# Altium project MANGO.PrjPCB
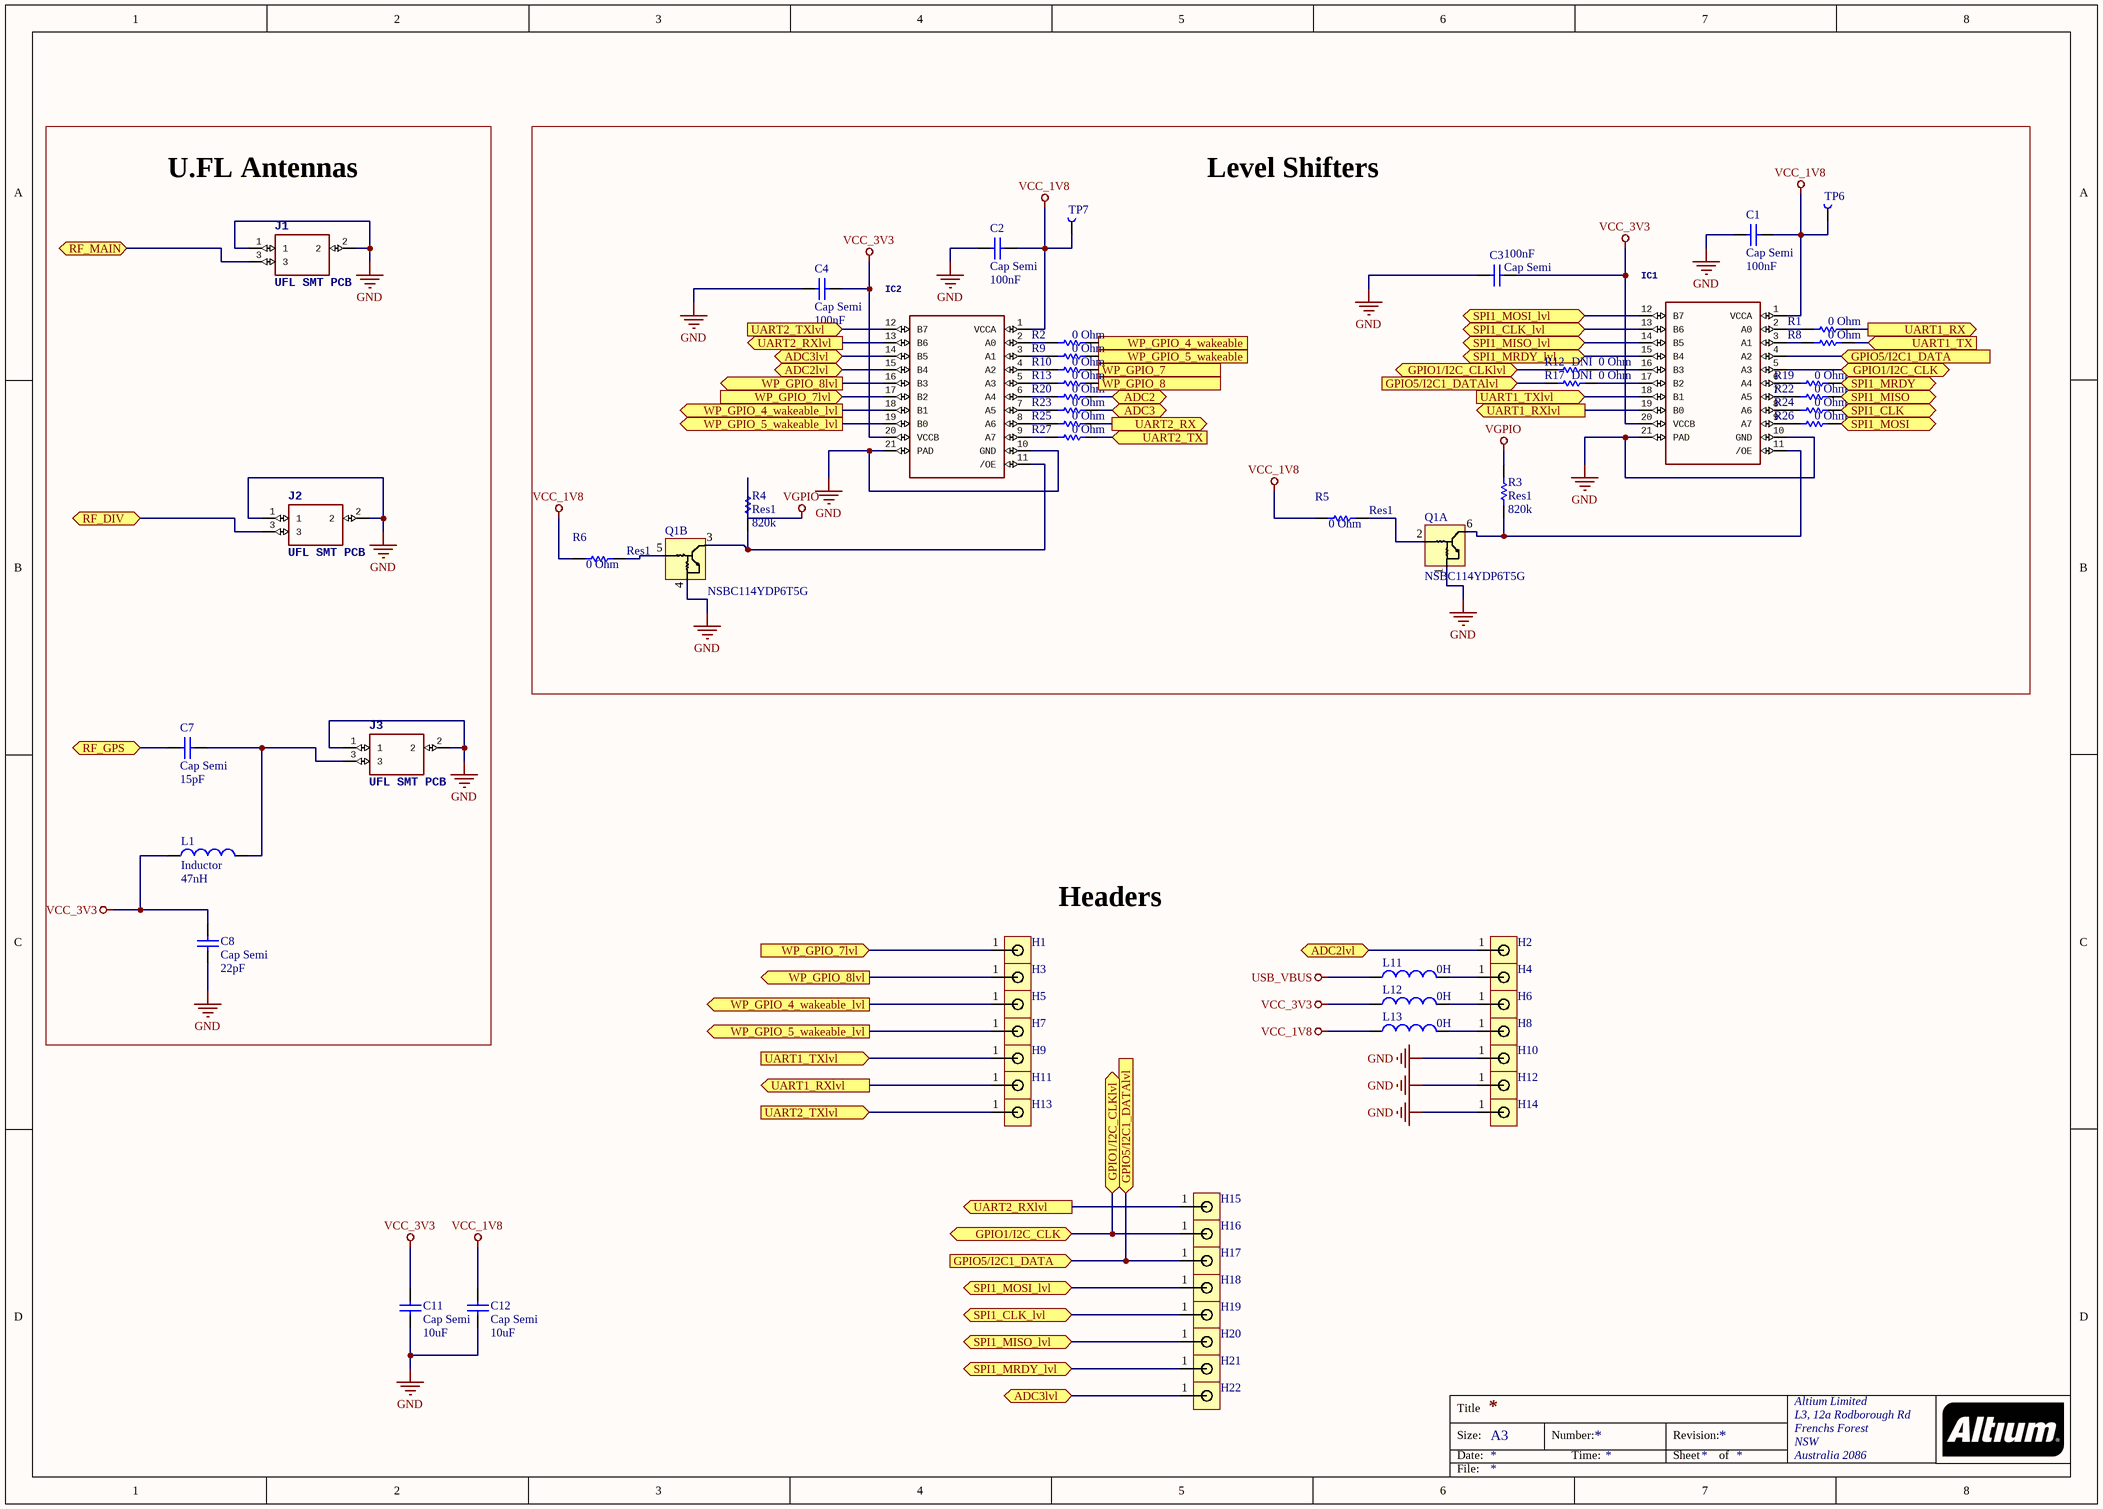
[diagram p0: Sheet1.SchDoc]
3 sheets, 93 parts. Net scope: flat (ports and power ports of the same name join across sheets).
Board file: PCB1.PcbDoc
Sheets:
  Sheet1.SchDoc
  Sheet3.SchDoc
  Sheet4.SchDoc

## Sheet Sheet1.SchDoc
size A3; Organization: Altium Limited; Address1: L3, 12a Rodborough Rd; Address2: Frenchs Forest; Address3: NSW; Address4: Australia 2086

### Parts
C1  Cap Semi  value 100nF  [CAP 0402/1005]
C2  Cap Semi  value 100nF  [CAP 0402/1005]
C3  Cap Semi  value 100nF  [CAP 0402/1005]
C4  Cap Semi  value 100nF  [CAP 0402/1005]
C7  Cap Semi  value 15pF  [CAP 0402/1005]
C8  Cap Semi  value 22pF  [CAP 0402/1005]
C11  Cap Semi  value 10uF  [CAP 0603/1608]
C12  Cap Semi  value 10uF  [CAP 0603/1608]
H1  Header 1  [PIN1-3D]  (value not drawn)
H2  Header 1  [PIN1-3D]  (value not drawn)
H3  Header 1  [PIN1-3D]  (value not drawn)
H4  Header 1  [PIN1-3D]  (value not drawn)
H5  Header 1  [PIN1-3D]  (value not drawn)
H6  Header 1  [PIN1-3D]  (value not drawn)
H7  Header 1  [PIN1-3D]  (value not drawn)
H8  Header 1  [PIN1-3D]  (value not drawn)
H9  Header 1  [PIN1-3D]  (value not drawn)
H10  Header 1  [PIN1-3D]  (value not drawn)
H11  Header 1  [PIN1-3D]  (value not drawn)
H12  Header 1  [PIN1-3D]  (value not drawn)
H13  Header 1  [PIN1-3D]  (value not drawn)
H14  Header 1  [PIN1-3D]  (value not drawn)
H15  Header 1  [PIN1-3D]  (value not drawn)
H16  Header 1  [PIN1-3D]  (value not drawn)
H17  Header 1  [PIN1-3D]  (value not drawn)
H18  Header 1  [PIN1-3D]  (value not drawn)
H19  Header 1  [PIN1-3D]  (value not drawn)
H20  Header 1  [PIN1-3D]  (value not drawn)
H21  Header 1  [PIN1-3D]  (value not drawn)
H22  Header 1  [PIN1-3D]  (value not drawn)
IC1  (no value)  [DQFN-20]
IC2  (no value)  [DQFN-20]
J1  UFL SMT PCB  [U.FL-R-SMT-1(10)]
J2  UFL SMT PCB  [U.FL-R-SMT-1(10)]
J3  UFL SMT PCB  [U.FL-R-SMT-1(10)]
L1  Inductor  value 47nH  [IND 0402/1005 RF WW]
L11  value 0H  [INDC1608L]  (hidden comment: Inductor)
L12  value 0H  [INDC1608L]  (hidden comment: Inductor)
L13  value 0H  [INDC1608L]  (hidden comment: Inductor)
Q1  NSBC114YDP6T5G  [NSBC114YDP6T5G]  (parts A,B of 2)
R1  value 0 Ohm  [RES 0402/1005]  (hidden comment: Res1)
R2  value 0 Ohm  [RES 0402/1005]  (hidden comment: Res1)
R3  Res1  value 820k  [RES 0402/1005]
R4  Res1  value 820k  [RES 0402/1005]
R5  Res1  value 0 Ohm  [RES 0402/1005]
R6  Res1  value 0 Ohm  [RES 0402/1005]
R8  value 0 Ohm  [RES 0402/1005]  (hidden comment: Res1)
R9  value 0 Ohm  [RES 0402/1005]  (hidden comment: Res1)
R10  value 0 Ohm  [RES 0402/1005]  (hidden comment: Res1)
R12  DNI  value 0 Ohm  [RES 0402/1005]
R13  value 0 Ohm  [RES 0402/1005]  (hidden comment: Res1)
R17  DNI  value 0 Ohm  [RES 0402/1005]
R19  value 0 Ohm  [RES 0402/1005]  (hidden comment: Res1)
R20  value 0 Ohm  [RES 0402/1005]  (hidden comment: Res1)
R22  value 0 Ohm  [RES 0402/1005]  (hidden comment: Res1)
R23  value 0 Ohm  [RES 0402/1005]  (hidden comment: Res1)
R24  value 0 Ohm  [RES 0402/1005]  (hidden comment: Res1)
R25  value 0 Ohm  [RES 0402/1005]  (hidden comment: Res1)
R26  value 0 Ohm  [RES 0402/1005]  (hidden comment: Res1)
R27  value 0 Ohm  [RES 0402/1005]  (hidden comment: Res1)
TP6  TestPoint  [TestPoint]  (value not drawn)
TP7  TestPoint  [TestPoint]  (value not drawn)

### Blocks framed on the sheet
U.FL Antennas: C7 C8 J1-J3 L1
Level Shifters: C1-C4 IC1 IC2 Q1 R1-R6 R8-R10 R12 R13 R17 R19 R20 R22-R27 TP6 TP7

### Ports
ADC2 (bidir), ADC2lvl (bidir), ADC3 (bidir), ADC3lvl (bidir), GPIO1/I2C_CLK (bidir), GPIO1/I2C_CLKlvl (bidir), GPIO5/I2C1_DATA (in), GPIO5/I2C1_DATAlvl (in), RF_DIV (bidir), RF_GPS (bidir), RF_MAIN (bidir), SPI1_CLK (bidir), SPI1_CLK_lvl (bidir), SPI1_MISO (bidir), SPI1_MISO_lvl (bidir), SPI1_MOSI (bidir), SPI1_MOSI_lvl (bidir), SPI1_MRDY (bidir), SPI1_MRDY_lvl (bidir), UART1_RX (out), UART1_RXlvl (out), UART1_TX (in), UART1_TXlvl (in), UART2_RX (out), UART2_RXlvl (out), UART2_TX (in), UART2_TXlvl (in), WP_GPIO_4_wakeable (out), WP_GPIO_4_wakeable_lvl (out), WP_GPIO_5_wakeable (out), WP_GPIO_5_wakeable_lvl (out), WP_GPIO_7 (in), WP_GPIO_7lvl (in), WP_GPIO_8 (out), WP_GPIO_8lvl (out)

### Nets
GND: C1.2 C2.2 C3.2 C4.2 C8.2 C11.1 C12.1 H10.1 H12.1 H14.1 IC1.10(GND) IC1.21(PAD) IC2.10(GND) IC2.21(PAD) J1.1 J1.2 J2.1 J2.2 J3.1 J3.2 Q1.1 Q1.4
USB_VBUS: L11.1
VCC_1V8: C1.1 C2.1 C12.2 IC1.1(VCCA) IC2.1(VCCA) L13.1 R5.1 R6.1 TP6.1(TP) TP7.1(TP)
VCC_3V3: C3.1 C4.1 C8.1 C11.2 IC1.20(VCCB) IC2.20(VCCB) L1.1 L12.1
VGPIO: R3.2 R4.2
NetC7_1: C7.1 J3.3 L1.2
NetC7_2: C7.2 ; port RF_GPS
NetH1_1: H1.1 IC2.17(B2) ; port WP_GPIO_7lvl
NetH2_1: H2.1 IC2.15(B4) ; port ADC2lvl
NetH3_1: H3.1 IC2.16(B3) ; port WP_GPIO_8lvl
NetH4_1: H4.1 L11.2
NetH5_1: H5.1 IC2.18(B1) ; port WP_GPIO_4_wakeable_lvl
NetH6_1: H6.1 L12.2
NetH7_1: H7.1 IC2.19(B0) ; port WP_GPIO_5_wakeable_lvl
NetH8_1: H8.1 L13.2
NetH9_1: H9.1 IC1.18(B1) ; port UART1_TXlvl
NetH11_1: H11.1 IC1.19(B0) ; port UART1_RXlvl
NetH13_1: H13.1 IC2.12(B7) ; port UART2_TXlvl
NetH15_1: H15.1 IC2.13(B6) ; port UART2_RXlvl
NetH16_1: H16.1 IC1.5(A3) R12.1 ; port GPIO1/I2C_CLK, port GPIO1/I2C_CLKlvl
NetH17_1: H17.1 IC1.4(A2) R17.1 ; port GPIO5/I2C1_DATA, port GPIO5/I2C1_DATAlvl
NetH18_1: H18.1 IC1.12(B7) ; port SPI1_MOSI_lvl
NetH19_1: H19.1 IC1.13(B6) ; port SPI1_CLK_lvl
NetH20_1: H20.1 IC1.14(B5) ; port SPI1_MISO_lvl
NetH21_1: H21.1 IC1.15(B4) ; port SPI1_MRDY_lvl
NetH22_1: H22.1 IC2.14(B5) ; port ADC3lvl
NetIC1_2: IC1.2(A0) R1.1
NetIC1_3: IC1.3(A1) R8.1
NetIC1_6: IC1.6(A4) R19.1
NetIC1_7: IC1.7(A5) R22.1
NetIC1_8: IC1.8(A6) R24.1
NetIC1_9: IC1.9(A7) R26.1
NetIC1_11: IC1.11(/OE) Q1.6 R3.1
NetIC1_16: IC1.16(B3) R12.2
NetIC1_17: IC1.17(B2) R17.2
NetIC2_2: IC2.2(A0) R2.1
NetIC2_3: IC2.3(A1) R9.1
NetIC2_4: IC2.4(A2) R10.1
NetIC2_5: IC2.5(A3) R13.1
NetIC2_6: IC2.6(A4) R20.1
NetIC2_7: IC2.7(A5) R23.1
NetIC2_8: IC2.8(A6) R25.1
NetIC2_9: IC2.9(A7) R27.1
NetIC2_11: IC2.11(/OE) Q1.3 R4.1
NetJ1_3: J1.3 ; port RF_MAIN
NetJ2_3: J2.3 ; port RF_DIV
NetQ1_2: Q1.2 R5.2
NetQ1_5: Q1.5 R6.2
NetR1_2: R1.2 ; port UART1_RX
NetR2_2: R2.2 ; port WP_GPIO_4_wakeable
NetR8_2: R8.2 ; port UART1_TX
NetR9_2: R9.2 ; port WP_GPIO_5_wakeable
NetR10_2: R10.2 ; port WP_GPIO_7
NetR13_2: R13.2 ; port WP_GPIO_8
NetR19_2: R19.2 ; port SPI1_MRDY
NetR20_2: R20.2 ; port ADC2
NetR22_2: R22.2 ; port SPI1_MISO
NetR23_2: R23.2 ; port ADC3
NetR24_2: R24.2 ; port SPI1_CLK
NetR25_2: R25.2 ; port UART2_RX
NetR26_2: R26.2 ; port SPI1_MOSI
NetR27_2: R27.2 ; port UART2_TX

### Notes on the sheet
- Headers
- Title
- Size:
- Date:
- A3
- Number:
- Time:
- Revision:
- Sheet
- of
- File:

### Library data of the parts
C1-C4 = Cap Semi: 0.1µF -20%, +80% 16V Ceramic Capacitor Y5V (F) 0402 (1005 Metric); Part Number: VJ0402V104ZXJCW1BC; Published: 8-Jun-2000; LatestRevisionDate: 29-May-2009; LatestRevisionNote: IPC-7351 Footprint Added.; PackageReference: C1206; PackageDescription: Chip Capacitor; Supplier Link: https://www.digikey.com/product-detail/en/vishay-vitramon/VJ0402V104ZXJCW1BC/720-1523-1-ND/420979
C7 = Cap Semi: 15pF ±5% 50V Ceramic Capacitor C0G, NP0 0402 (1005 Metric); Part Number: UMK105CG150JV-F; LatestRevisionDate: 29-May-2009; LatestRevisionNote: IPC-7351 Footprint Added.; PackageReference: C1206; PackageDescription: Chip Capacitor; Supplier Link: https://www.digikey.com/product-detail/en/taiyo-yuden/UMK105CG150JV-F/587-1949-1-ND/1473259
C8 = Cap Semi: CAP CER 22PF 50V NP0 0402; Part Number: UMK105CG220JV-F; Published: 8-Jun-2000; LatestRevisionDate: 29-May-2009; LatestRevisionNote: IPC-7351 Footprint Added.; PackageReference: C1206; PackageDescription: Chip Capacitor; Supplier Link: https://www.digikey.com/product-detail/en/taiyo-yuden/UMK105CG220JV-F/587-1203-1-ND/930980
C11 C12 = Cap Semi: 10µF ±20% 6.3V Ceramic Capacitor X5R 0603 (1608 Metric); Part Number: JMK107BJ106MA-T; LatestRevisionDate: 29-May-2009; LatestRevisionNote: IPC-7351 Footprint Added.; PackageReference: C1206; Publisher: Altium Limited; PackageDescription: Chip Capacitor; Supplier Link: https://www.digikey.com/product-detail/en/taiyo-yuden/JMK107BJ106MA-T/587-1256-1-ND/931033
IC1 IC2 = FXMA108BQX: Voltage Level Translator Bidirectional 1 Circuit 8 Channel 100Mbps 20-DQFN (2.5x4.5); Manufacturer_Name: Fairchild Semiconductor; GateName_1: G$1; SymbolName_1: FXMA108BQX; LibraryName: FXMA108BQX; DeviceSetName: FXMA108BQX; Package: DQFN-20; Part Number: FXMA108BQX; Mouser_Part_Number: 512-FXMA108BQX; Supplier Link: https://www.digikey.com/product-detail/en/on-semiconductor/FXMA108BQX/FXMA108BQXFSCT-ND/2287325; RS_Part_Number: 8076121P; RS_Price-Stock: http://uk.rs-online.com/web/p/products/8076121P; Height: mm
J1-J3 = U.FL-R-SMT-1(10): U.FL (UMCC), IPEX MHF1 Connector Receptacle, Male Pin 50 Ohm Surface Mount Solder; Part Number: 20279-001E-01; Manufacturer_Name: Taoglas; Manufacturer_Part_Number: U.FL-R-SMT-1(10); Height: mm; Supplier Link: https://www.digikey.com/products/en?keywords=20279-001E-01
L1 = Inductor: 47nH Unshielded Multilayer Inductor 250mA 1.15 Ohm Max 0402 (1005 Metric); Part Number: LQG15HN47NJ02D; Code_IEC: 1005; Published: 8-Jun-2000; LatestRevisionDate: 29-May-2009; LatestRevisionNote: IPC-7351 Footprint Added.; PackageReference: 0402-A; PackageDescription: Chip Inductor; Code_JEITA: 0402; Supplier Link: https://www.digikey.com/product-detail/en/murata-electronics-north-america/LQG15HN47NJ02D/490-1093-1-ND/584539
L11-L13 = Inductor: 220 Ohms @ 100MHz 1 Power Line Ferrite Bead 0603 (1608 Metric) 2.2A 50 mOhm; Part Number: MPZ1608S221ATA00; Code_IEC: 1005; Published: 8-Jun-2000; LatestRevisionDate: 29-May-2009; LatestRevisionNote: IPC-7351 Footprint Added.; PackageReference: 0402-A; Publisher: Altium Limited; PackageDescription: Chip Inductor; Code_JEITA: 0402; Supplier Link: https://www.digikey.com/product-detail/en/tdk-corporation/MPZ1608S221ATA00/445-1565-1-ND/571895
Q1 = NSBC114YDP6T5G: Pre-Biased Bipolar Transistor (BJT) 2 NPN - Pre-Biased (Dual) 50V 100mA  339mW Surface Mount SOT-963; Part Number: NSBC114YDP6T5G; Supplier Link: https://www.digikey.com/product-detail/en/on-semiconductor/NSBC114YDP6T5G/NSBC114YDP6T5GOSCT-ND/9087466
R1 R2 R5 R6 R8-R10 R12 R13 R17 R19 R20 R22-R27 = Res1: 0 Ohms Jumper  Chip Resistor 0402 (1005 Metric) Automotive AEC-Q200 Metal Element; Part Number: RK73Z1ETTP; Published: 8-Jun-2000; LatestRevisionDate: 17-Jul-2002; LatestRevisionNote: Re-released for DXP Platform.; PackageReference: AXIAL-0.3; PackageDescription: Axial Device, Thru-Hole; 2 Leads; 0.3 in Pin Spacing; Supplier Link: https://www.digikey.com/product-detail/en/koa-speer-electronics-inc/RK73Z1ETTP/2019-RK73Z1ETTPCT-ND/9846740
R3 R4 = Res1: 820 kOhms ±1% 0.063W, 1/16W Chip Resistor 0402 (1005 Metric) Moisture Resistant Thick Film; Part Number: RC0402FR-07820KL; Published: 8-Jun-2000; LatestRevisionDate: 17-Jul-2002; LatestRevisionNote: Re-released for DXP Platform.; PackageReference: AXIAL-0.3; PackageDescription: Axial Device, Thru-Hole; 2 Leads; 0.3 in Pin Spacing; Supplier Link: https://www.digikey.com/product-detail/en/yageo/RC0402FR-07820KL/YAG3240CT-ND/5282105

## Sheet Sheet3.SchDoc
size A4; Organization: Altium Limited; Address1: L3, 12a Rodborough Rd; Address2: Frenchs Forest; Address3: NSW; Address4: Australia 2086
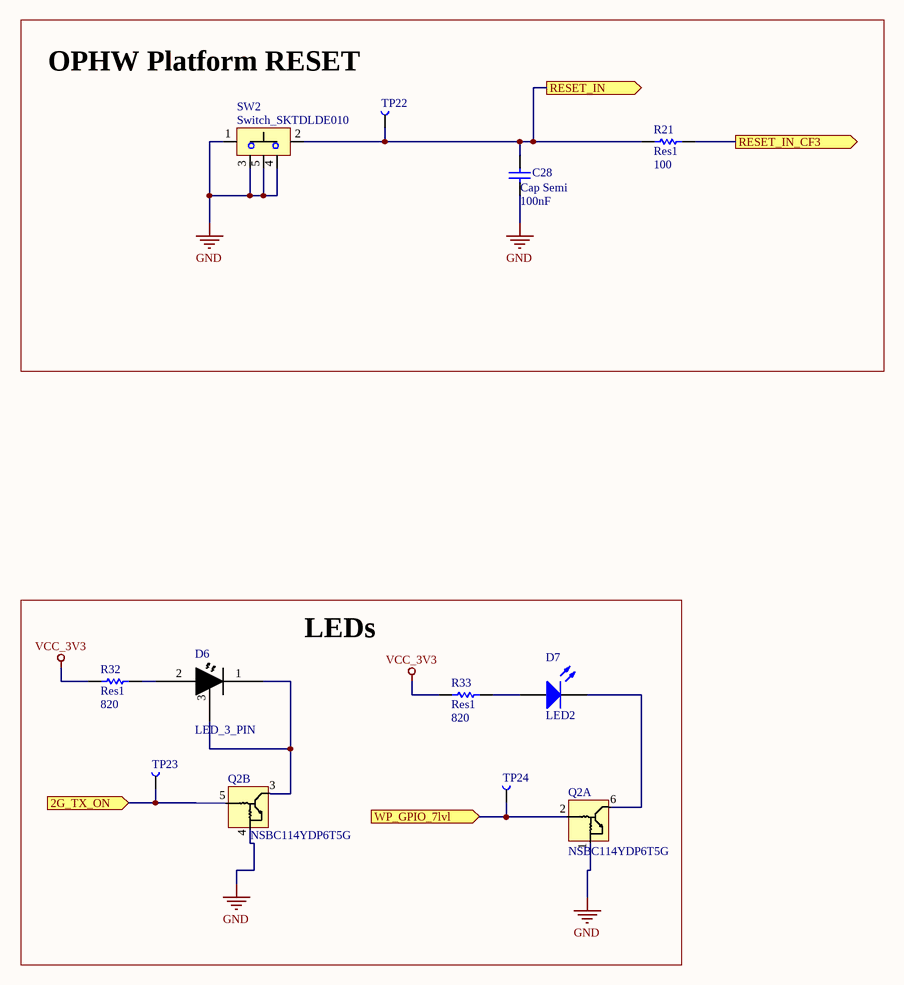
[diagram p1: Sheet3.SchDoc]

### Parts
C28  Cap Semi  value 100nF  [CAP 0402/1005]
D6  LED_3_PIN  [LED_3_PIN]
D7  LED2  [LED_0603 - 3D]
Q2  NSBC114YDP6T5G  [NSBC114YDP6T5G]  (parts A,B of 2)
R21  Res1  value 100  [RES 0402/1005]
R32  Res1  value 820  [RES 0402/1005]
R33  Res1  value 820  [RES 0402/1005]
SW2  Switch_SKTDLDE010  [Switch_SKTDLDE010]
TP22  TestPoint  [TestPoint]  (value not drawn)
TP23  TestPoint  [TestPoint]  (value not drawn)
TP24  TestPoint  [TestPoint]  (value not drawn)

### Blocks framed on the sheet
OPHW Platform RESET: C28 R21 SW2 TP22
LEDs: D6 D7 Q2 R32 R33 TP23 TP24

### Ports
2G_TX_ON (in), RESET_IN (out), RESET_IN_CF3 (out), WP_GPIO_7lvl (in)

### Nets
GND: C28.1 Q2.1 Q2.4 SW2.1 SW2.3 SW2.4 SW2.5
VCC_3V3: R32.2 R33.2
NetC28_2: C28.2 R21.1 SW2.2 TP22.1(TP) ; port RESET_IN
NetD6_1: D6.1 D6.3 Q2.3
NetD6_2: D6.2 R32.1
NetD7_1: D7.1(A) R33.1
NetD7_2: D7.2(K) Q2.6
NetH1_1: Q2.2 TP24.1(TP) ; port WP_GPIO_7lvl
NetQ2_5: Q2.5 TP23.1(TP) ; port 2G_TX_ON
NetR21_2: R21.2 ; port RESET_IN_CF3

### Notes on the sheet
- Title
- Size:
- Date:
- A4
- Number:
- Time:
- Revision:
- Sheet
- of
- File:

### Library data of the parts
C28 = Cap Semi: as C1 on sheet Sheet1; Published: 8-Jun-2000; LatestRevisionDate: 29-May-2009; LatestRevisionNote: IPC-7351 Footprint Added.; PackageReference: C1206; PackageDescription: Chip Capacitor; Supplier Link: https://www.digikey.com/product-detail/en/vishay-vitramon/VJ0402V104ZXJCW1BC/720-1523-1-ND/420979
D6 = LED_3_PIN: Yellow-Green 573nm LED Indication - Discrete 2V 2-SMD, No Lead; Part Number: 12-21SYGC/S530-E2/TR8; Supplier Link: https://www.digikey.com/product-detail/en/everlight-electronics-co-ltd/12-21SYGC-S530-E2-TR8/1080-1451-1-ND/5308153
D7 = LED2: Green  LED Indication - Discrete 2.2V 0603 (1608 Metric); Part Number: SML-310MTT86; Published: 8-Jun-2000; LatestRevisionDate: 17-Jul-2002; LatestRevisionNote: Re-released for DXP Platform.; PackageVersion: Feb-2002; PackageReference: 3.2X1.6X1.1; Publisher: Altium Limited; PackageDescription: SM LED; 2 Flat Leads; Supplier Link: https://www.digikey.com/products/en?keywords=SML-310MTT86M
Q2 = NSBC114YDP6T5G: as Q1 on sheet Sheet1; Part Number: NSBC114YDP6T5G; Supplier Link: https://www.digikey.com/product-detail/en/on-semiconductor/NSBC114YDP6T5G/NSBC114YDP6T5GOSCT-ND/9087466
R21 = Res1: 100 Ohms ±5% 0.063W, 1/16W Chip Resistor 0402 (1005 Metric) Automotive AEC-Q200 Thick Film; Part Number: MCR01MZPJ101; Available: 0; Published: 8-Jun-2000; LatestRevisionDate: 17-Jul-2002; LatestRevisionNote: Re-released for DXP Platform.; PackageReference: AXIAL-0.3; PackageDescription: Axial Device, Thru-Hole; 2 Leads; 0.3 in Pin Spacing; Supplier Link: https://www.digikey.com/product-detail/en/rohm-semiconductor/MCR01MZPJ101/RHM100JCT-ND/628224; Supplier Link 2: https://www.digikey.com/product-detail/en/yageo/AC0402JR-07100RL/YAG3516CT-ND/6006365; Part Number 2: AC0402JR-07100RL
R32 R33 = Res1: 820 Ohms ±5% 0.1W, 1/10W Chip Resistor 0402 (1005 Metric) Automotive AEC-Q200 Thick Film; Part Number: RK73B1ETTP821J; Published: 8-Jun-2000; LatestRevisionDate: 17-Jul-2002; LatestRevisionNote: Re-released for DXP Platform.; PackageReference: AXIAL-0.3; PackageDescription: Axial Device, Thru-Hole; 2 Leads; 0.3 in Pin Spacing; Supplier Link: https://www.digikey.com/product-detail/en/koa-speer-electronics-inc/RK73B1ETTP821J/2019-RK73B1ETTP821JCT-ND/9846073
SW2 = Switch_SKTDLDE010: Tactile Switches Tact Switch; Part Number: SKTDLDE010; Supplier Link: https://eu.mouser.com/ProductDetail/ALPS/SKTDLDE010?qs=RiQAlOPxzzDSD3ErBzCWyg%3D%3D

## Sheet Sheet4.SchDoc
size A3; Organization: Altium Limited; Address1: L3, 12a Rodborough Rd; Address2: Frenchs Forest; Address3: NSW; Address4: Australia 2086
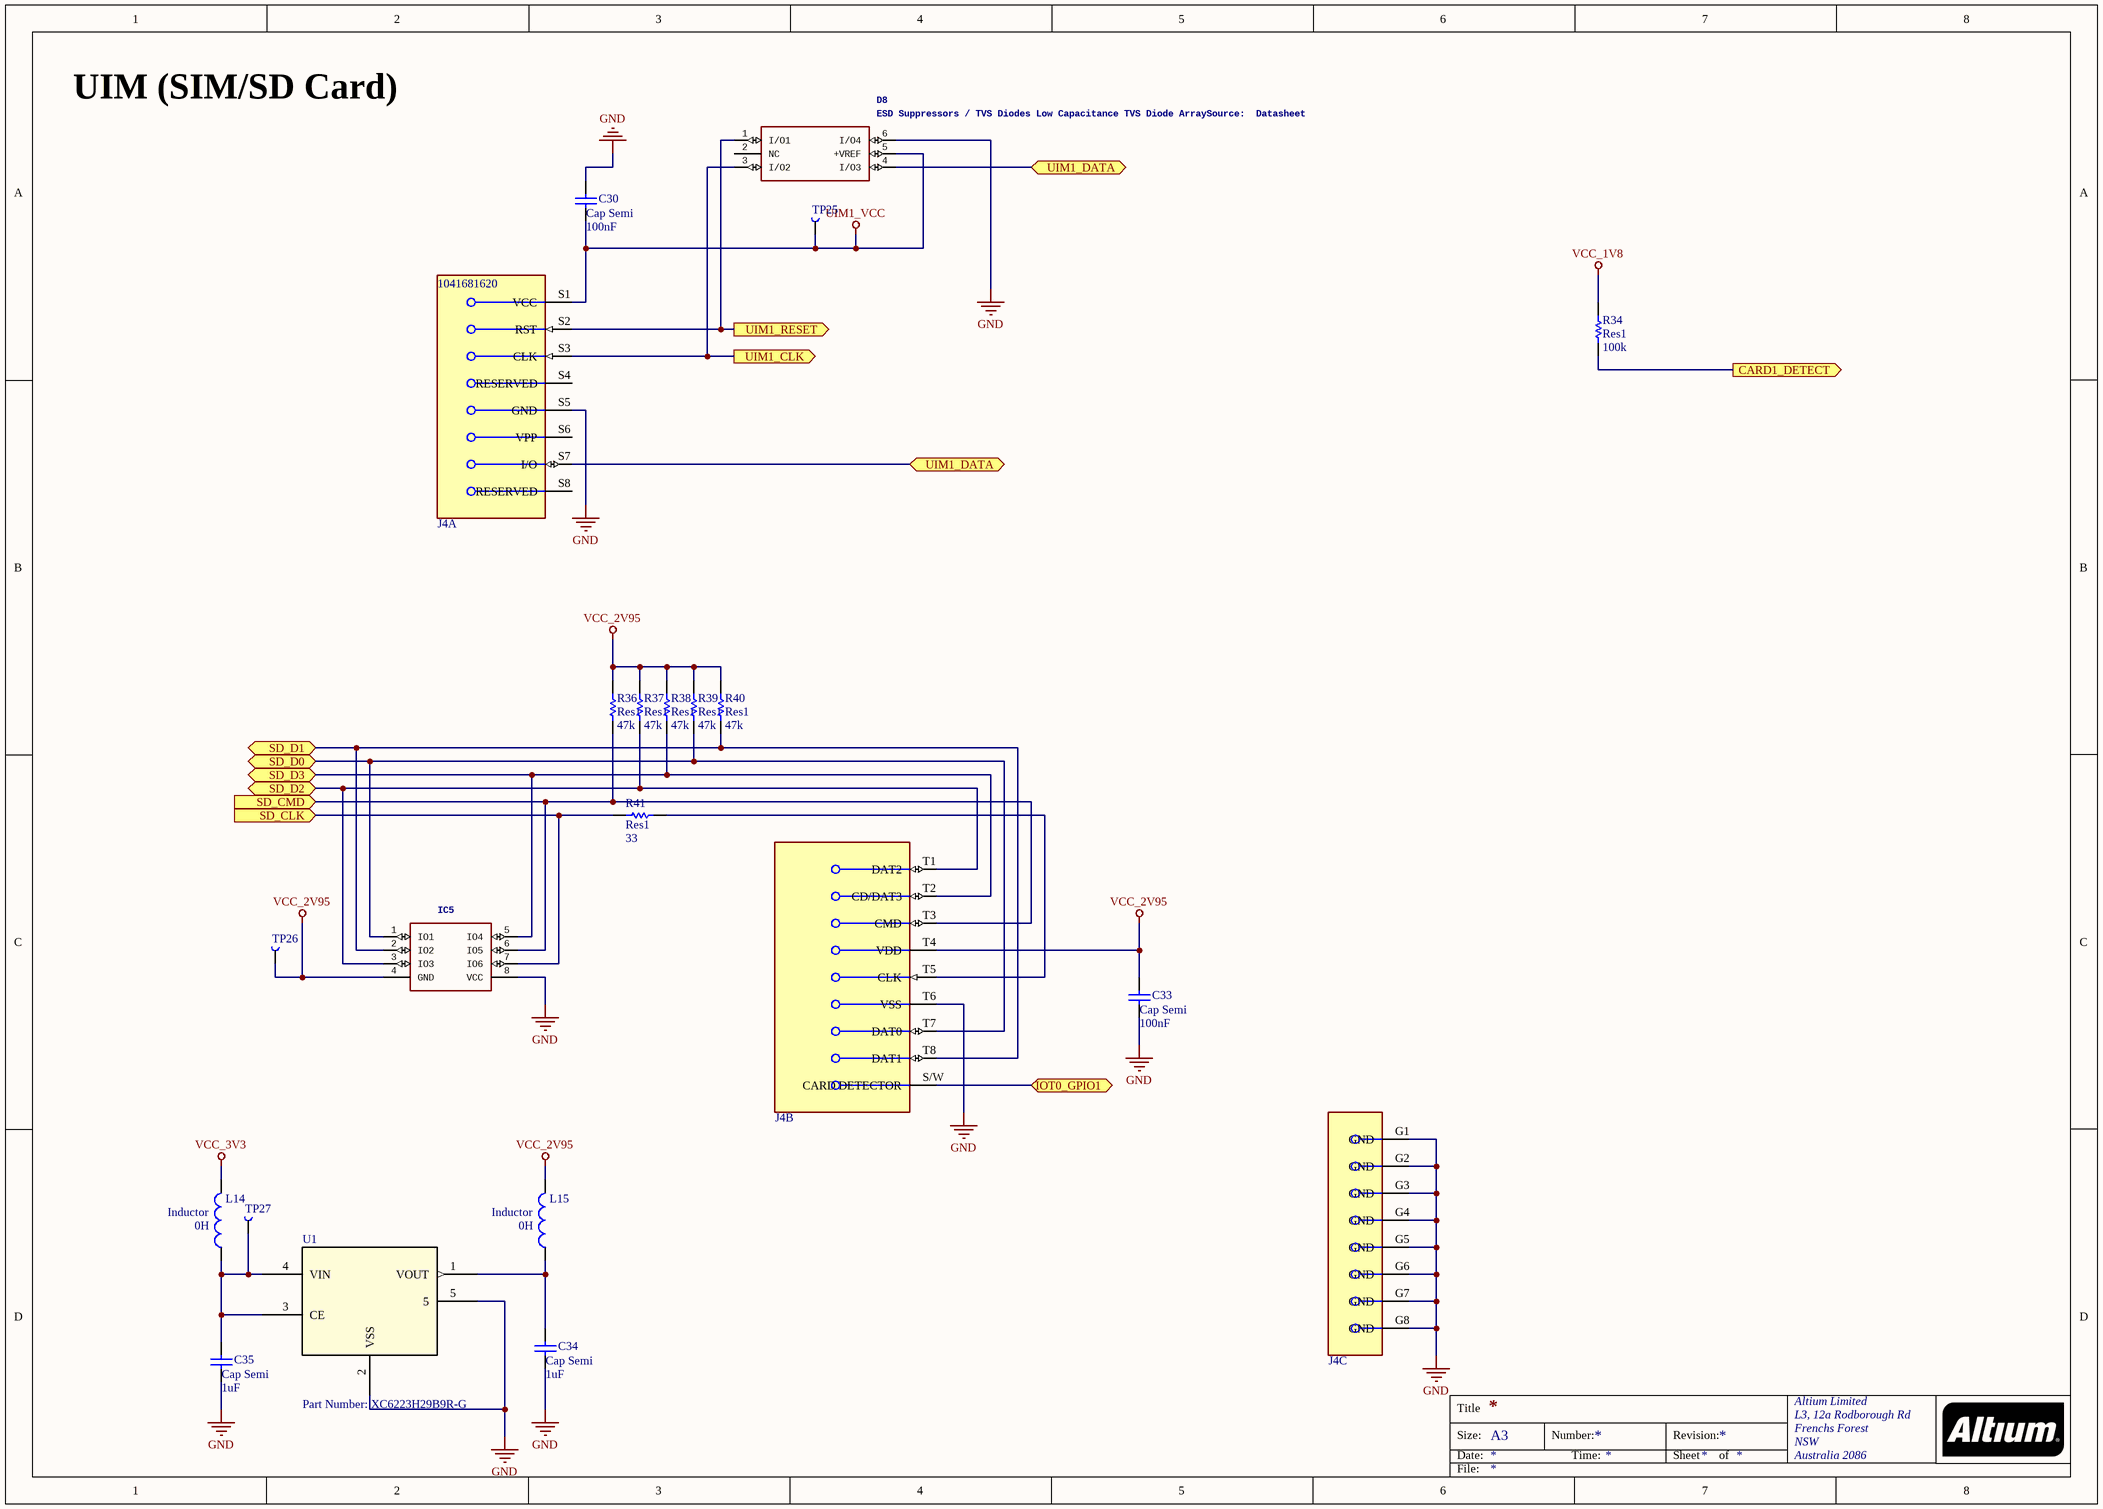
[diagram p2: Sheet4.SchDoc]

### Parts
C30  Cap Semi  value 100nF  [CAP 0402/1005]
C33  Cap Semi  value 100nF  [CAP 0402/1005]
C34  Cap Semi  value 1uF  [CAP 0402/1005]
C35  Cap Semi  value 1uF  [CAP 0402/1005]
D8  ESD Suppressors / TVS Diodes Low Capacitance TVS Diode ArraySource:  Datasheet  [SON50P100X145X65-6N]
IC5  (no value)  [RSE0008A]
J4  104168-1620  [Molex_104168-1620_MFG]  (value not drawn)  (parts A,B,C of 3)
L14  Inductor  value 0H  [INDC1608L]
L15  Inductor  value 0H  [INDC1608L]
R34  Res1  value 100k  [RES 0402/1005]
R36  Res1  value 47k  [RES 0402/1005]
R37  Res1  value 47k  [RES 0402/1005]
R38  Res1  value 47k  [RES 0402/1005]
R39  Res1  value 47k  [RES 0402/1005]
R40  Res1  value 47k  [RES 0402/1005]
R41  Res1  value 33  [RES 0402/1005]
TP25  TestPoint  [TestPoint]  (value not drawn)
TP26  TestPoint  [TestPoint]  (value not drawn)
TP27  TestPoint  [TestPoint]  (value not drawn)
U1  Part Number: XC6223H29B9R-G  [USPQ-4B03]

### Ports
CARD1_DETECT (out), IOT0_GPIO1 (bidir), SD_CLK (in), SD_CMD (in), SD_D0 (bidir), SD_D1 (bidir), SD_D2 (bidir), SD_D3 (bidir), UIM1_CLK (out), UIM1_DATA (bidir), UIM1_RESET (out)

### Nets
GND: C30.2 C33.1 C34.1 C35.1 D8.6(I/O4) IC5.8(VCC) J4.G1(GND) J4.G2(GND) J4.G3(GND) J4.G4(GND) J4.G5(GND) J4.G6(GND) J4.G7(GND) J4.G8(GND) J4.S5(GND) J4.T6(VSS) U1.2(VSS) U1.5
UIM1_VCC: C30.1 D8.5(+VREF) J4.S1(VCC) TP25.1(TP)
VCC_1V8: R34.1
VCC_2V95: C33.2 IC5.4(GND) J4.T4(VDD) L15.2 R36.2 R37.2 R38.2 R39.2 R40.2 TP26.1(TP)
VCC_3V3: L14.2
NetC34_2: C34.2 L15.1 U1.1(VOUT)
NetC35_2: C35.2 L14.1 TP27.1(TP) U1.3(CE) U1.4(VIN)
NetD8_1: D8.1(I/O1) J4.S2(RST) ; port UIM1_RESET
NetD8_3: D8.3(I/O2) J4.S3(CLK) ; port UIM1_CLK
NetD8_4: D8.4(I/O3) J4.S7(I/O) ; port UIM1_DATA
NetIC5_1: IC5.1(IO1) J4.T7(DAT0) R39.1 ; port SD_D0
NetIC5_2: IC5.2(IO2) J4.T8(DAT1) R40.1 ; port SD_D1
NetIC5_3: IC5.3(IO3) J4.T1(DAT2) R37.1 ; port SD_D2
NetIC5_5: IC5.5(IO4) J4.T2(CD/DAT3) R38.1 ; port SD_D3
NetIC5_6: IC5.6(IO5) J4.T3(CMD) R36.1 ; port SD_CMD
NetIC5_7: IC5.7(IO6) R41.2 ; port SD_CLK
NetJ4_S/W: J4.S/W(CARD_DETECTOR) ; port IOT0_GPIO1
NetJ4_T5: J4.T5(CLK) R41.1
NetR34_2: R34.2 ; port CARD1_DETECT

Not connected (* = marked no-connect by the designer): D8 2(NC); J4 S4(RESERVED) S6(VPP) S8(RESERVED)

### Notes on the sheet
- UIM (SIM/SD Card)
- Title
- Size:
- Date:
- A3
- Number:
- Time:
- Revision:
- Sheet
- of
- File:

### Library data of the parts
C30 C33 = Cap Semi: as C1 on sheet Sheet1; Published: 8-Jun-2000; LatestRevisionDate: 29-May-2009; LatestRevisionNote: IPC-7351 Footprint Added.; PackageReference: C1206; PackageDescription: Chip Capacitor
  C30: Supplier Link: *
  C33: Supplier Link: https://www.digikey.com/product-detail/en/vishay-vitramon/VJ0402V104ZXJCW1BC/720-1523-1-ND/420979
C34 C35 = Cap Semi: 1µF ±10% 10V Ceramic Capacitor X5R 0402 (1005 Metric); Part Number: GRM155R61A105KE15D; Available: 0; Published: 8-Jun-2000; LatestRevisionDate: 29-May-2009; LatestRevisionNote: IPC-7351 Footprint Added.; PackageReference: C1206; PackageDescription: Chip Capacitor; Supplier Link: https://www.digikey.com/product-detail/en/murata-electronics-north-america/GRM155R61A105KE15D/490-3890-1-ND/965932; Supplier Link 2: https://www.digikey.com/product-detail/en/taiyo-yuden/LMK105BJ105KVHF/587-3712-6-ND/4811286; Part Number 2: LMK105BJ105KVHF
D8 = RCLAMP0503N.TCT: 30V Clamp 3A (8/20µs) Ipp Tvs Diode Surface Mount SLP1510N6; Manufacturer_Name: SEMTECH; GateName_1: G$1; SymbolName_1: RCLAMP0503N.TCT; LibraryName: RCLAMP0503N.TCT; DeviceSetName: RCLAMP0503N.TCT; Package: SON50P100X145X65-6N; Manufacturer_Part_Number: RCLAMP0503N.TCT; Mouser_Part_Number: 947-RCLAMP0503N.TCT; Mouser_Price-Stock: https://www.mouser.com/Search/Refine.aspx?Keyword=947-RCLAMP0503N.TCT; RS_Part_Number: 947-RCLAMP0503N.TCT; RS_Price-Stock: https://www.mouser.com/Search/Refine.aspx?Keyword=947-RCLAMP0503N.TCT; Height: 0.65mm; Part Number: RCLAMP0503N.TCT; Supplier Link: https://www.digikey.com/product-detail/en/semtech-corporation/RCLAMP0503N.TCT/RCLAMP0503N.TCTCT-ND/5113715
IC5 = TPD6E004RSER: Clamp  Ipp Tvs Diode Surface Mount 8-UQFN (1.5x1.5); Manufacturer_Name: Texas Instruments; GateName_1: G$1; SymbolName_1: TPD6E004RSER; LibraryName: TPD6E004RSER; DeviceSetName: TPD6E004RSER; Package: RSE0008A; Part Number: TPD6E004RSER; Mouser_Part_Number: 595-TPD6E004RSER; Mouser_Price-Stock: https://www.mouser.com/Search/Refine.aspx?Keyword=595-TPD6E004RSER; RS_Part_Number: 1626446; RS_Price-Stock: http://uk.rs-online.com/web/p/products/1626446; Height: mm; Supplier Link: https://www.digikey.com/product-detail/en/texas-instruments/TPD6E004RSER/296-23619-1-ND/1913507
J4 = 104168-1620: 8 Position Card Connector Combo - microSD™, Micro SIM Surface Mount, Right Angle Gold; Part Number: 1041681620; Supplier Link: https://www.digikey.com/product-detail/en/molex/1041681620/WM12820CT-ND/5823214
L14 L15 = Inductor: as L11 on sheet Sheet1; Published: 8-Jun-2000; LatestRevisionDate: 29-May-2009; LatestRevisionNote: IPC-7351 Footprint Added.; PackageReference: 0402-A; Publisher: Altium Limited; PackageDescription: Chip Inductor; Code_JEITA: 0402; Supplier Link: https://www.digikey.com/product-detail/en/tdk-corporation/MPZ1608S221ATA00/445-1565-1-ND/571895
R34 = Res1: 100 kOhms ±1% 0.1W, 1/10W Chip Resistor 0402 (1005 Metric) Automotive AEC-Q200 Thick Film; Part Number: RK73H1ETTP1003F; Published: 8-Jun-2000; LatestRevisionDate: 17-Jul-2002; LatestRevisionNote: Re-released for DXP Platform.; PackageReference: AXIAL-0.3; PackageDescription: Axial Device, Thru-Hole; 2 Leads; 0.3 in Pin Spacing; Supplier Link: https://www.digikey.com/product-detail/en/koa-speer-electronics-inc/RK73H1ETTP1003F/2019-RK73H1ETTP1003FCT-ND/9846200
R36-R40 = Res1: 47 kOhms ±5% 0.063W, 1/16W Chip Resistor 0402 (1005 Metric) Moisture Resistant Thick Film; Part Number: RC0402JR-0747KL; Published: 8-Jun-2000; LatestRevisionDate: 17-Jul-2002; LatestRevisionNote: Re-released for DXP Platform.; PackageReference: AXIAL-0.3; PackageDescription: Axial Device, Thru-Hole; 2 Leads; 0.3 in Pin Spacing; Supplier Link: https://www.digikey.com/product-detail/en/yageo/RC0402JR-0747KL/311-47KJRCT-ND/729432
R41 = Res1: 33 Ohms ±5% 0.1W, 1/10W Chip Resistor 0402 (1005 Metric) Automotive AEC-Q200 Thick Film; Part Number: RK73B1ETTP330J; Published: 8-Jun-2000; LatestRevisionDate: 17-Jul-2002; LatestRevisionNote: Re-released for DXP Platform.; PackageReference: AXIAL-0.3; PackageDescription: Axial Device, Thru-Hole; 2 Leads; 0.3 in Pin Spacing; Supplier Link: https://www.digikey.com/product-detail/en/koa-speer-electronics-inc/RK73B1ETTP330J/2019-RK73B1ETTP330JCT-ND/9846009
U1 = XC6223H29B9R-G: LDO Voltage Regulators; Vendor: Torex Semiconductor; Built_By: EMA_UL_Team; Copyright: Copyright (C) 2018 Accelerated Designs. All rights reserved; RefDes: RefDes; Type: DEV; Value: Value; Supplier Link: https://eu.mouser.com/ProductDetail/Torex-Semiconductor/XC6223H29B9R-G?qs=%2Fha2pyFadujZ3DCSmHHHg6sdaRWvEXKOM0E8R6SW2XDQmdh01F6iPg%3D%3D

## Nets that join several sheets
GND: Sheet1 (22 pins), Sheet3 (7 pins), Sheet4 (18 pins)
VCC_1V8: Sheet1 (10 pins), Sheet4 (R34.1)
VCC_3V3: Sheet1 (8 pins), Sheet3 (R32.2 R33.2), Sheet4 (L14.2)
NetH1_1: Sheet1 (H1.1 IC2.17), Sheet3 (Q2.2 TP24.1)